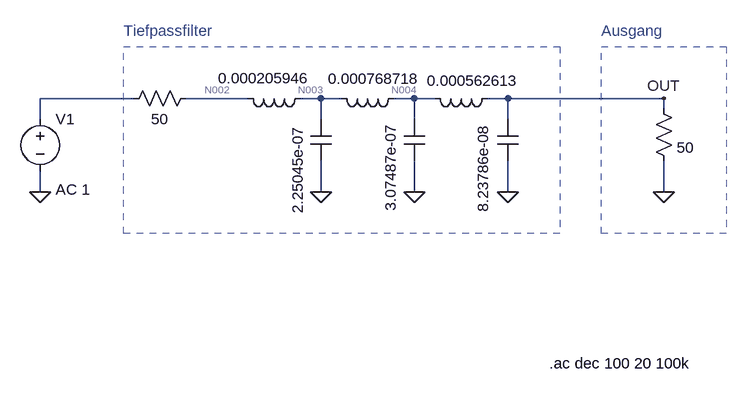
[diagram p0: schematic test_filter.asc]
test_filter.asc, the LTspice schematic file:
Version 4
SHEET 1 2376 996
WIRE 944 256 800 256
WIRE 1120 256 1024 256
WIRE 1232 256 1200 256
WIRE 1264 256 1232 256
WIRE 1376 256 1344 256
WIRE 1408 256 1376 256
WIRE 1520 256 1488 256
WIRE 1760 256 1520 256
WIRE 1760 272 1760 256
WIRE 800 288 800 256
WIRE 1232 288 1232 256
WIRE 1376 288 1376 256
WIRE 1520 288 1520 256
WIRE 800 400 800 368
WIRE 1232 400 1232 352
WIRE 1376 400 1376 352
WIRE 1520 400 1520 352
WIRE 1760 400 1760 352
FLAG 1760 400 0
FLAG 1232 400 0
FLAG 1376 400 0
FLAG 1520 400 0
FLAG 1760 256 OUT
FLAG 800 400 0
SYMBOL res 1040 240 R90
WINDOW 0 0 56 Invisible 2
WINDOW 3 32 56 VTop 2
SYMATTR InstName R1
SYMATTR Value 50
SYMBOL ind 1216 240 R90
WINDOW 0 5 56 Invisible 2
WINDOW 3 -31 71 VTop 2
SYMATTR InstName L1
SYMATTR Value 0.000205946
SYMBOL ind 1360 240 R90
WINDOW 0 5 56 Invisible 2
WINDOW 3 -30 46 VTop 2
SYMATTR InstName L2
SYMATTR Value 0.000768718
SYMBOL ind 1504 240 R90
WINDOW 0 5 56 Invisible 2
WINDOW 3 -27 38 VTop 2
SYMATTR InstName L3
SYMATTR Value 0.000562613
SYMBOL cap 1216 288 R0
WINDOW 0 24 8 Invisible 2
WINDOW 3 -20 9 VRight 2
SYMATTR InstName C1
SYMATTR Value 2.25045e-07
SYMBOL cap 1360 288 R0
WINDOW 0 24 8 Invisible 2
WINDOW 3 -21 5 VRight 2
SYMATTR InstName C2
SYMATTR Value 3.07487e-07
SYMBOL cap 1504 288 R0
WINDOW 0 24 8 Invisible 2
WINDOW 3 -22 7 VRight 2
SYMATTR InstName C3
SYMATTR Value 8.23786e-08
SYMBOL res 1744 256 R0
WINDOW 0 36 40 Invisible 2
SYMATTR InstName R2
SYMATTR Value 50
SYMBOL voltage 800 272 R0
WINDOW 123 24 124 Left 2
WINDOW 39 0 0 Left 2
SYMATTR InstName V1
SYMATTR Value ""
SYMATTR Value2 AC 1
TEXT 1584 664 Left 2 !.ac dec 100 20 100k
TEXT 928 152 Left 2 ;Tiefpassfilter
TEXT 1664 152 Left 2 ;Ausgang
RECTANGLE Normal 1600 464 928 176 2
RECTANGLE Normal 1856 464 1664 176 2

The netlist it stands for:
* test_filter.asc
R1 N002 N001 50
L1 N003 N002 0.000205946
L2 N004 N003 0.000768718
L3 OUT N004 0.000562613
C1 N003 0 2.25045e-07
C2 N004 0 3.07487e-07
C3 OUT 0 8.23786e-08
R2 OUT 0 50
V1 N001 0 AC 1
.ac dec 100 20 100k
* Tiefpassfilter
* Ausgang
.backanno
.end

* Results of the author's LTspice run, read from the files saved beside the schematic
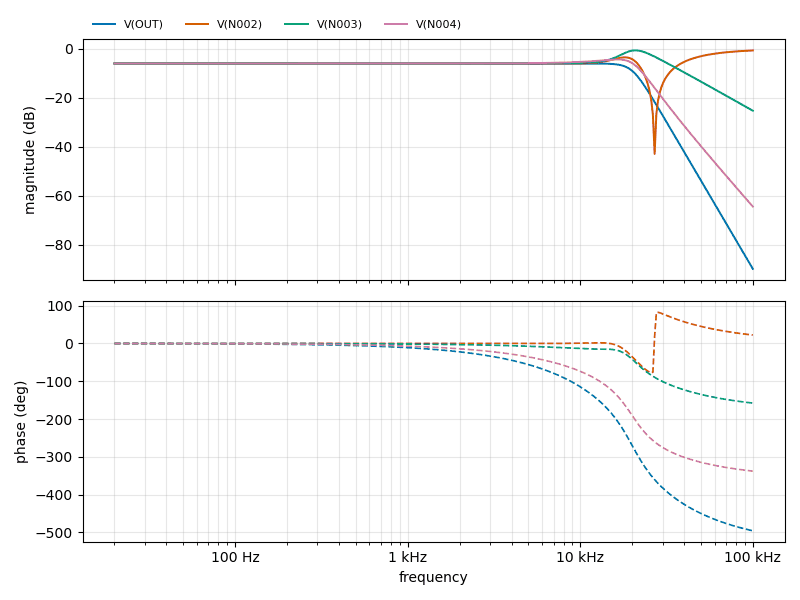
[diagram p1: AC Analysis of test_filter.asc, plotted from the saved traces]
* AC Analysis, 1 run:
*   V(OUT): -6.02 dB at 20 Hz, -89.89 dB at 100 kHz, peak -6.02 dB at 20 Hz, 3 dB below the peak at 20 kHz
*   V(N002): -6.02 dB at 20 Hz, -0.67 dB at 100 kHz, peak -0.67 dB at 100 kHz, 3 dB below the peak at 46.21 kHz
*   V(N003): -6.02 dB at 20 Hz, -25.29 dB at 100 kHz, peak -0.64 dB at 20.94 kHz, 3 dB below the peak at 15.84 kHz and 27.77 kHz
*   V(N004): -6.02 dB at 20 Hz, -64.46 dB at 100 kHz, peak -4.36 dB at 16.64 kHz, 3 dB below the peak at 21.3 kHz